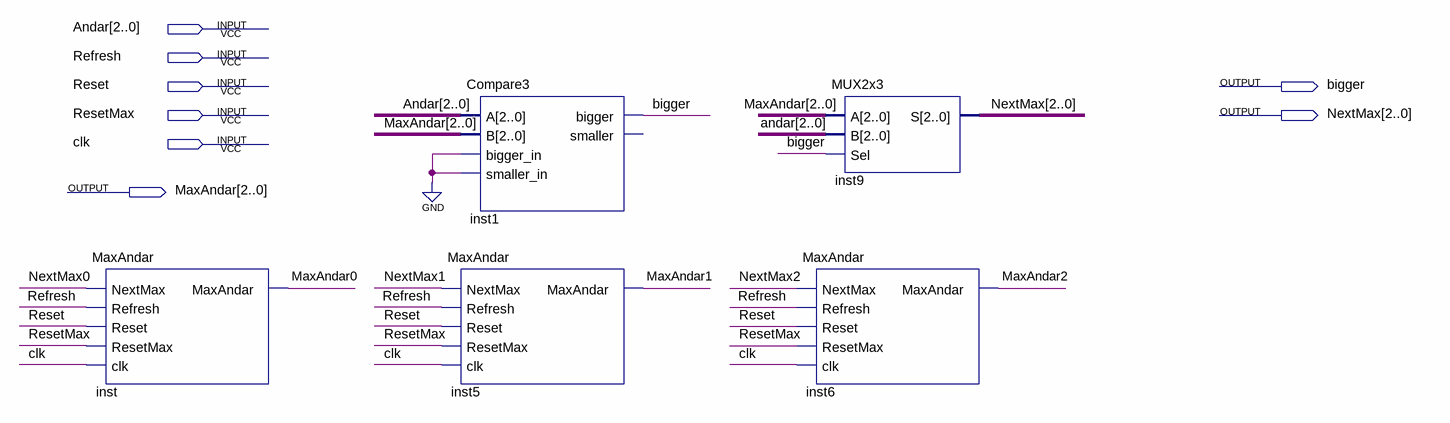
[diagram p0: schematic sheet]
// Quartus schematic MaxAndar3.bdf as structural Verilog: 5 symbols, 8 pins
module MaxAndar3 (
  input  [2:0] Andar,
  input  Refresh,
  input  Reset,
  input  ResetMax,
  input  clk,
  output bigger,
  output [2:0] NextMax,
  output [2:0] MaxAndar
);

  MaxAndar inst (
    .NextMax(NextMax[0]), .Refresh(Refresh), .Reset(Reset), .ResetMax(ResetMax), .clk(clk),
    .MaxAndar(MaxAndar[0]));
  Compare3 inst1 (.A(Andar), .B(MaxAndar), .bigger_in(1'b0), .smaller_in(1'b0), .bigger(bigger));  // open: smaller
  MaxAndar inst5 (
    .NextMax(NextMax[1]), .Refresh(Refresh), .Reset(Reset), .ResetMax(ResetMax), .clk(clk),
    .MaxAndar(MaxAndar[1]));
  MaxAndar inst6 (
    .NextMax(NextMax[2]), .Refresh(Refresh), .Reset(Reset), .ResetMax(ResetMax), .clk(clk),
    .MaxAndar(MaxAndar[2]));
  MUX2x3 inst9 (.A(MaxAndar), .B(Andar), .Sel(bigger), .S(NextMax));
endmodule
